# EAGLE design paddle (EAGLE 6.5.2)
1D 4K Paddle Controller
VERSION: 1.0
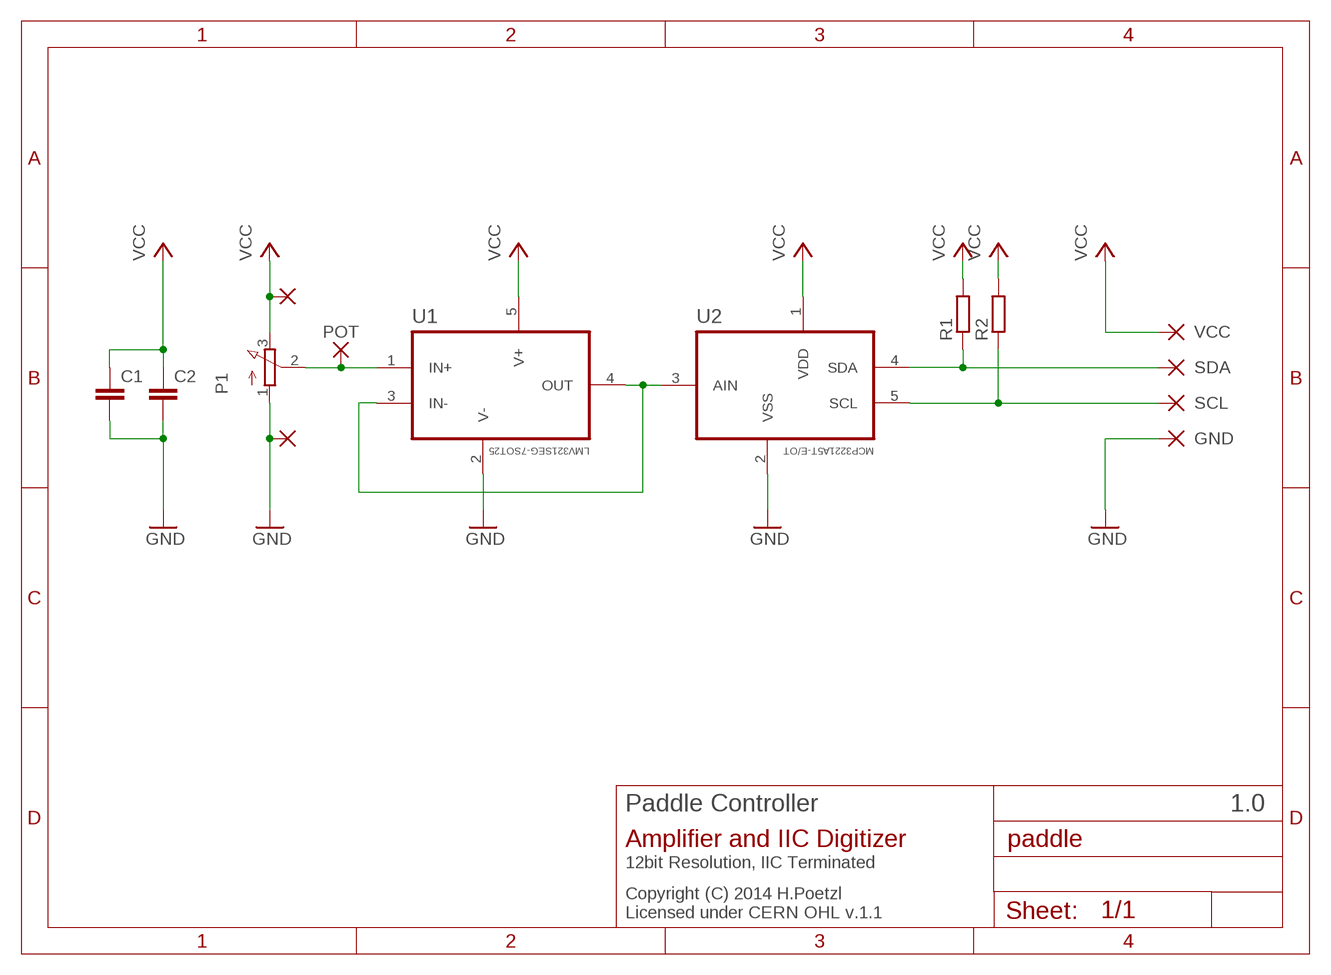
[diagram p0: schematic, sheet 1]

## Parts
C1  C-EUC1206K  [C1206K]
C2  C-EUC1206K  [C1206K]
GND  SMD2  [SMD1,27-2,54]
P1  3RP/1610N  [3RP/1610N]
POT  SMD2  [SMD1,27-2,54]
R1  R-EU_0204/7  [0204/7]
R2  R-EU_0204/5  [0204/5]
SCL  SMD2  [SMD1,27-2,54]
SDA  SMD2  [SMD1,27-2,54]
U1  LMV321SEG-7SOT25  [SOT95P280X145-5N]
U2  MCP3221A5T-E/OT  [SOT95P270X145-5N]
VCC  SMD2  [SMD1,27-2,54]
VCC1  SMD2  [SMD1,27-2,54]
VCC2  SMD2  [SMD1,27-2,54]

## Nets
GND: C1.2 C2.2 GND.1(P) P1.1(A) U1.2(V-) U2.2(VSS) VCC2.1(P)
N$6: U1.3(IN-) U1.4(OUT) U2.3(AIN)
POT: P1.2(S) POT.1(P) U1.1(IN+)
SCL: R2.1 SCL.1(P) U2.5(SCL)
SDA: R1.1 SDA.1(P) U2.4(SDA)
VCC: C1.1 C2.1 P1.3(E) R1.2 R2.2 U1.5(V+) U2.1(VDD) VCC1.1(P) VCC.1(P)

## Notes on the sheet
- Paddle Controller
- Amplifier and IIC Digitizer
- 12bit Resolution, IIC Terminated
- Copyright (C) 2014 H.Poetzl
  Licensed under CERN OHL v.1.1

## Library data of the parts
C1 C2 = rcl:C-EU: CAPACITOR, European symbol
GND POT SCL SDA VCC VCC1 VCC2 = wirepad:SMD2: SMD PAD
P1 = pot:3RP/1610N: 16mm Potentiometer one level Source: http://www.alphapotentiometers.net/html/16mm_pot_2.html
R1 R2 = rcl:R-EU_: RESISTOR, European symbol
U1 = lmv321:LMV321SEG-7: OPERATIONAL AMPLIFIERS
U2 = mcp3221:MCP3221A5T-E/OT: A/D Converter; MPN: MCP3221A5T-E/OT; OC_FARNELL: 1332098; OC_NEWARK: 34M7446; PACKAGE: SOT-5; SUPPLIER: Microchip

## Board
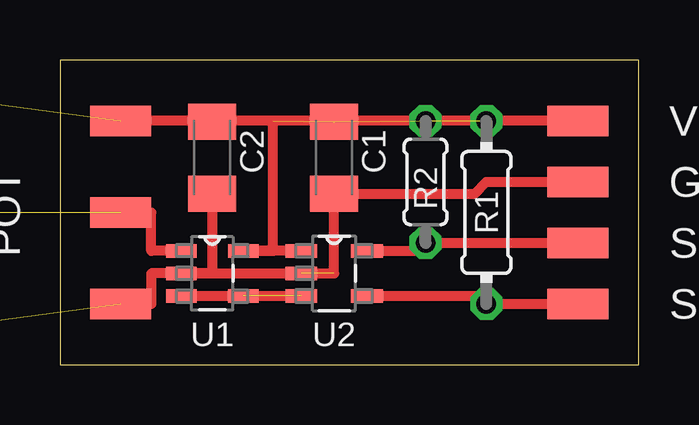
[diagram p1: board, top side]
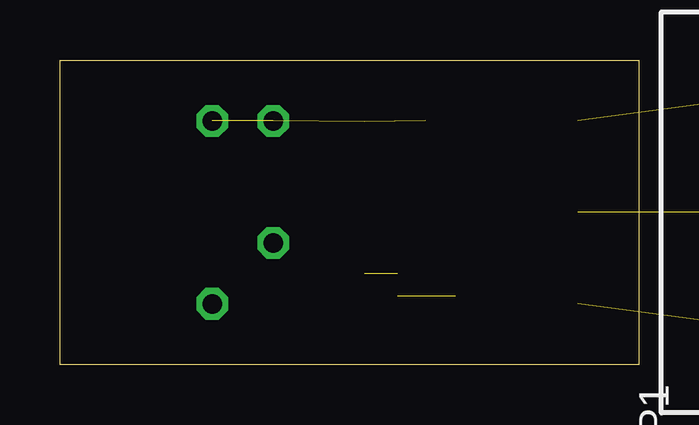
[diagram p2: board, bottom side, seen from below]

Size 24.13 x 12.7 mm. Coordinates in mm from the lower left corner, seen from the top.
Outline: 0,0 24.13,0 24.13,12.7 0,12.7 0,0
Copper layers (1*16): Top 0.035mm / dielectric 1.5mm / Bottom 0.035mm
Design rules "default": minimum track width 10mil, minimum drill 24mil, track to track 8mil, track to pad 8mil, pad to pad 8mil, via to via 8mil, smd to smd 8mil, copper to edge 40mil, drill to drill 8mil, minimum pad ring 10mil, minimum via ring 8mil, stop-mask expansion 4mil, vias tented up to drill 0mil, thermal gap 10mil

### Footprints (pad centres in the part's own frame; a part is rotated, then mirrored left to right if it is on the bottom)
C1206K = smd 1.5 x 2: 1 -1.5,0; 2 1.5,0
SMD1,27-2,54 = smd 1.27 x 2.54: 1 0,0
3RP/1610N = drill 1.2 pad 2.184: 1 -5,0; 2 0,0; 3 5,0
0204/7 = drill 0.813 octagon: 1 -3.81,0; 2 3.81,0
0204/5 = drill 0.813 octagon: 1 -2.54,0; 2 2.54,0
SOT95P280X145-5N = smd 1.27 x 0.559: 1 -1.295,0.94; 2 -1.295,0; 3 -1.295,-0.94; 4 1.295,-0.94; 5 1.295,0.94
SOT95P270X145-5N = smd 1.321 x 0.559: 1 -1.372,0.94; 2 -1.372,0; 3 -1.372,-0.94; 4 1.372,-0.94; 5 1.372,0.94

### Placement (x,y rotation side)
C1  11.43,8.64 270 top
C2  6.35,8.64 270 top
GND  21.59,7.62 90 top
P1  -6.35,6.35 90 bottom  (outside the outline)
POT  2.54,6.35 90 top
R1  17.78,6.35 90 top
R2  15.24,7.62 90 top
SCL  21.59,5.08 90 top
SDA  21.59,2.54 90 top
U1  6.35,3.81 0 top
U2  11.43,3.81 0 top
VCC  21.59,10.16 90 top
VCC1  2.54,10.16 90 top
VCC2  2.54,2.54 90 top

### Tracks (layer width: path | path; a pad name or v marks a point on that pad's centre or on a via)
GND  (2 unrouted)
  Top 0.406: C2.2 6.35,3.81 U1.2 | U1.2 11.43,3.81 C1.2 17.3,7.14 17.78,7.62 GND.1 | U1.2 3.81,3.81 3.81,2.54 VCC2.1
N$6  (1 unrouted)
  Top 0.406: U1.3 U2.3
POT  (1 unrouted)
  Top 0.406: U1.1 3.81,4.75 3.81,6.35 POT.1
SCL
  Top 0.406: U2.5 15.24,4.75 R2.1 SCL.1
SDA
  Top 0.406: U2.4 17.78,2.87 R1.1 SDA.1
VCC  (4 unrouted)
  Top 0.406: VCC.1 8.89,10.16 | 8.89,10.16 6.37,10.16 C2.1 6.33,10.16 VCC1.1 | U2.1 U1.5 8.89,4.75 8.89,10.16